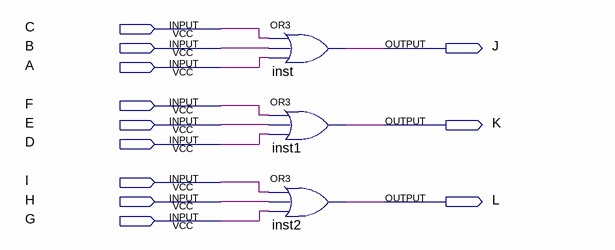
[diagram p0: schematic sheet]
// Quartus schematic CD4075.bdf as structural Verilog: 3 symbols, 12 pins
module CD4075 (
  input  C,
  input  B,
  input  A,
  input  F,
  input  E,
  input  D,
  input  I,
  input  H,
  input  G,
  output J,
  output K,
  output L
);

  or inst (J, C, B, A);
  or inst1 (K, F, E, D);
  or inst2 (L, I, H, G);
endmodule
